# EAGLE design CH1 (EAGLE 9.2.2)
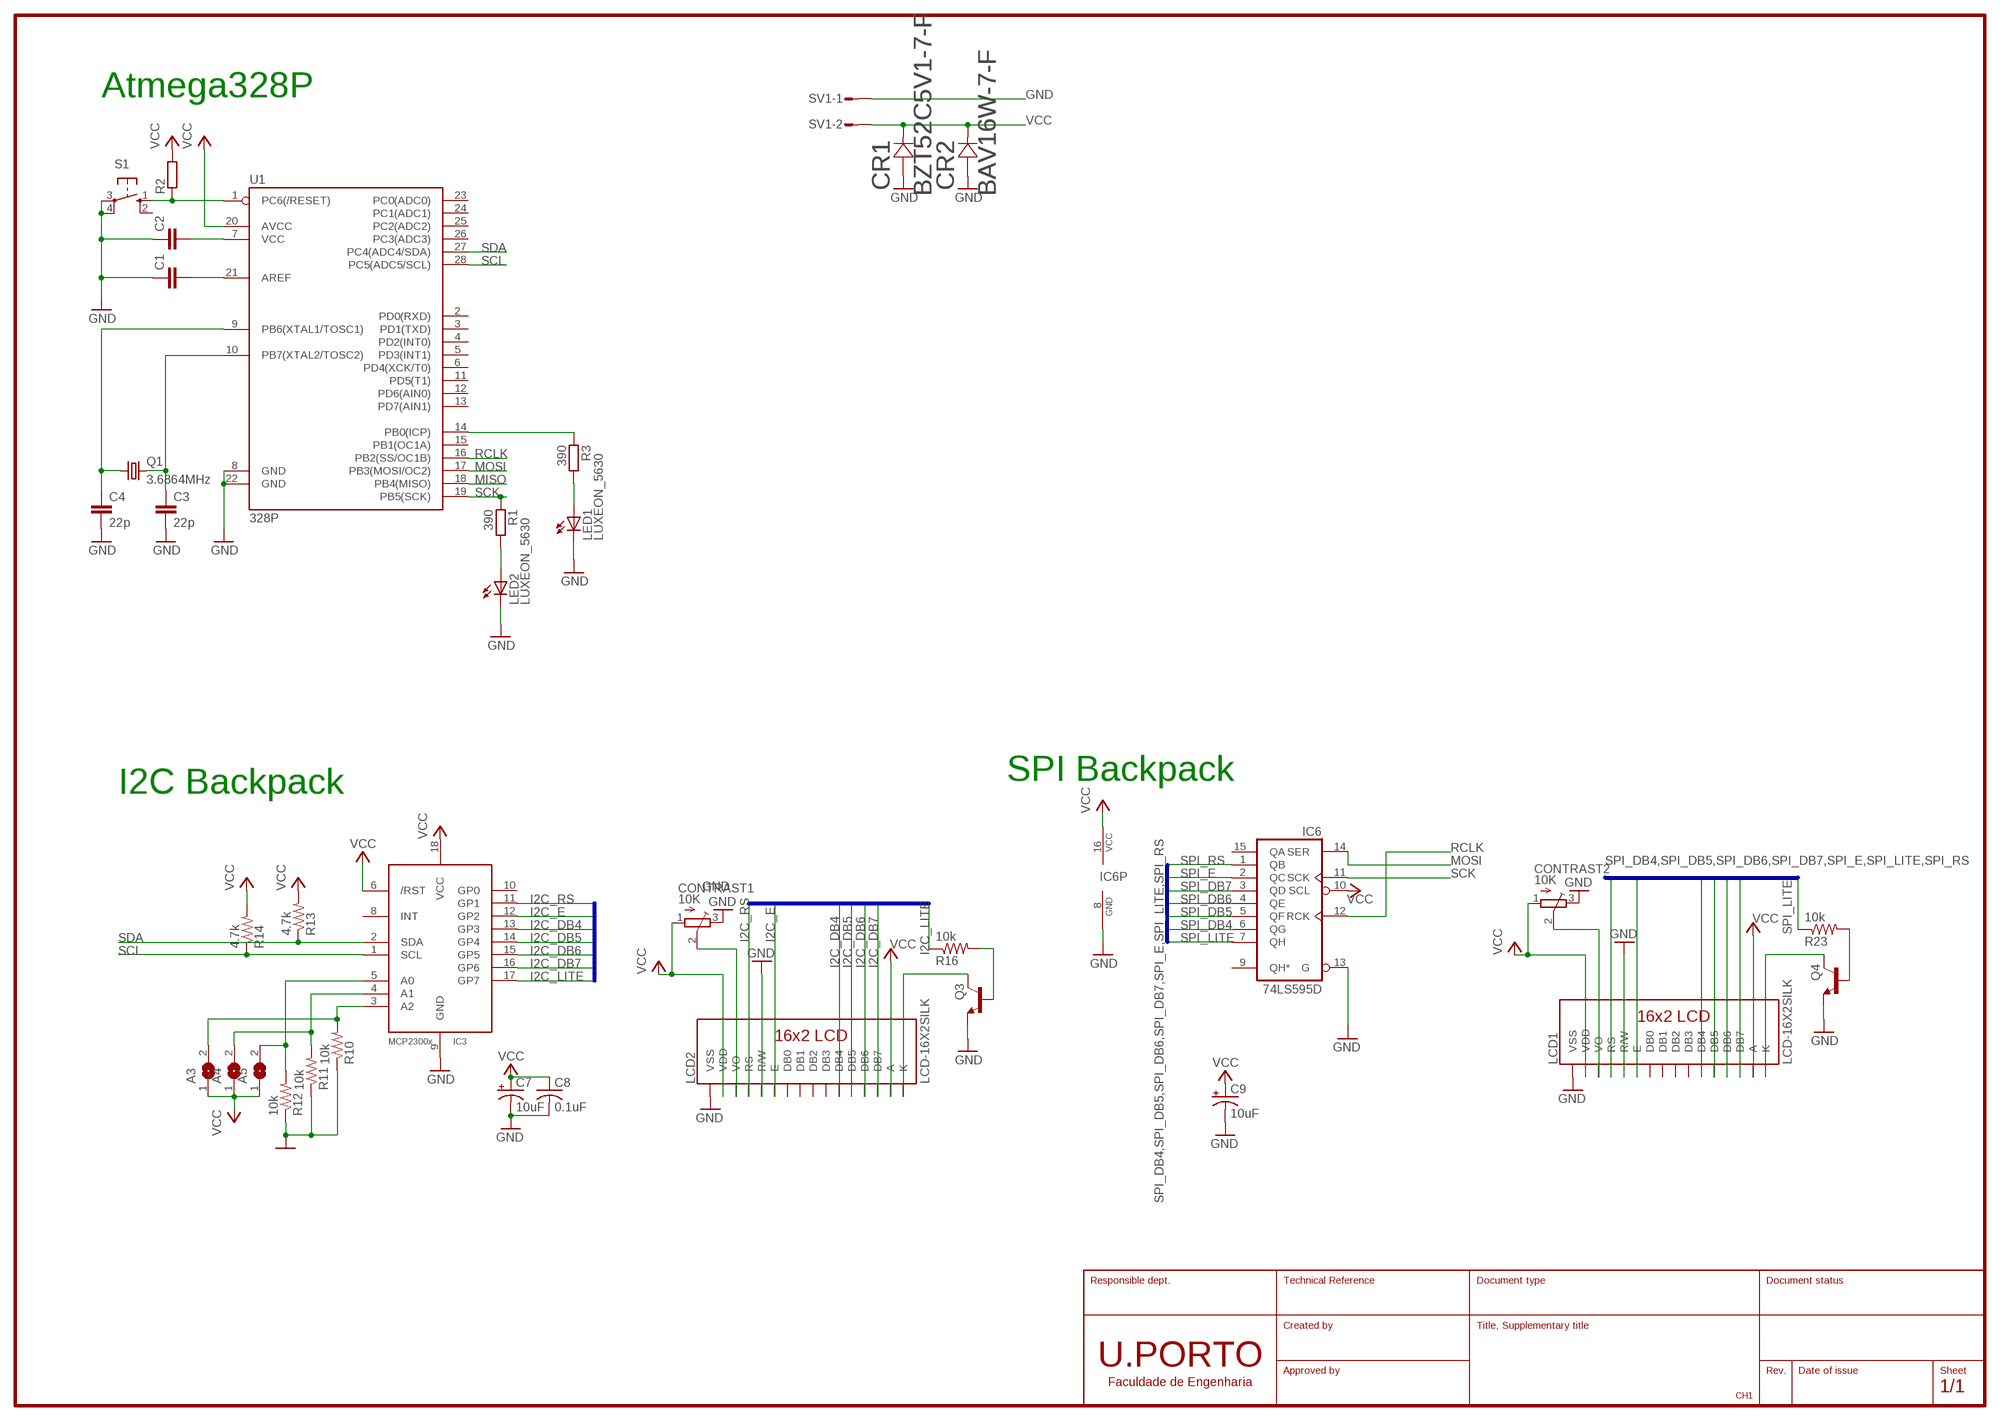
[diagram p0: schematic, sheet 1]

## Parts
A3  SJ  [SJ]
A4  SJ  [SJ]
A5  SJ  [SJ]
C1  C-EUC1206  [C1206]
C2  C-EUC1206  [C1206]
C3  22p  C-EUC1206  [C1206]
C4  22p  C-EUC1206  [C1206]
C7  10uF  CPOL-USA/3216-18R  [A/3216-18R]
C8  0.1uF  C-USC0805K  [C0805K]
C9  10uF  CPOL-USA/3216-18R  [A/3216-18R]
CONTRAST1  10K  TRIMPOTTC33X  [TC33X]
CONTRAST2  10K  TRIMPOTTC33X  [TC33X]
CR1  BZT52C5V1-7-F  [SOD123]
CR2  BAV16W-7-F  [SOD123]
IC3  MCP2300X/SO  [SO18W]
IC6  74LS595D  [SO16]
LCD1  LCD-16X2SILK  [LCD-16X2]
LCD2  LCD-16X2SILK  [LCD-16X2]
LED1  LUXEON_5630  [LUXEON_5630]
LED2  LUXEON_5630  [LUXEON_5630]
Q1  3.6864MHz  CRYSTALHC49S  [HC49/S]
Q3  MMBT2222ALT1-NPN-SOT23-BEC  [SOT23-BEC]
Q4  MMBT2222ALT1-NPN-SOT23-BEC  [SOT23-BEC]
R1  390  R-EU_R1206  [R1206]
R2  R-EU_R1206  [R1206]
R3  390  R-EU_R1206  [R1206]
R10  10k  R-US_R0805  [R0805]
R11  10k  R-US_R0805  [R0805]
R12  10k  R-US_R0805  [R0805]
R13  4.7k  R-US_R0805  [R0805]
R14  4.7k  R-US_R0805  [R0805]
R16  10k  R-US_R0805  [R0805]
R23  10k  R-US_R0805  [R0805]
S1  SWITCH-OMRON  [SWITCH-OMRON_B3F-10XX]
SV1  L02P  [L02P]
U1  328P  ATMEGA328P-PDIP  [MICROCONTROLLER_DIP28]

## Nets
GND: C1.1 C2.1 C3.2 C4.2 C7.- C8.2 C9.- CONTRAST1.3(E) CONTRAST2.3(E) CR1.2 CR2.2 IC3.9(GND) IC6.8(GND) IC6.13(G) LCD1.1(VSS) LCD1.5(R/W) LCD2.1(VSS) LCD2.5(R/W) LED1.1@1(C) LED1.1@2(C) LED2.1@1(C) LED2.1@2(C) Q3.E Q4.E R10.1 R11.1 R12.1 S1.3(P) S1.4(P1) SV1.1 U1.8(GND) U1.22(GND)
I2C_DB4: IC3.13(GP3) LCD2.11(DB4)
I2C_DB5: IC3.14(GP4) LCD2.12(DB5)
I2C_DB6: IC3.15(GP5) LCD2.13(DB6)
I2C_DB7: IC3.16(GP6) LCD2.14(DB7)
I2C_E: IC3.12(GP2) LCD2.6(E)
I2C_LITE: IC3.17(GP7) R16.1
I2C_RS: IC3.11(GP1) LCD2.4(RS)
MISO: U1.18(PB4(MISO))
MOSI: IC6.14(SER) U1.17(PB3(MOSI/OC2))
N$1: C3.1 Q1.2 U1.10(PB7(XTAL2/TOSC2))
N$2: C4.1 Q1.1 U1.9(PB6(XTAL1/TOSC1))
N$3: C2.2 U1.7(VCC)
N$4: C1.2 U1.21(AREF)
N$5: LED1.2(A) R3.2
N$6: LED2.2(A) R1.2
N$7: R2.1 S1.1(S) U1.1(PC6(/RESET))
N$8: R3.1 U1.14(PB0(ICP))
N$14: A5.2 IC3.5(A0) R12.2
N$15: A4.2 IC3.4(A1) R11.2
N$16: A3.2 IC3.3(A2) R10.2
N$18: LCD2.16(K) Q3.C
N$19: Q3.B R16.2
N$20: CONTRAST1.2(S) LCD2.3(VO)
N$25: LCD1.16(K) Q4.C
N$26: Q4.B R23.2
N$27: CONTRAST2.2(S) LCD1.3(VO)
RCLK: IC6.12(RCK) U1.16(PB2(SS/OC1B))
SCK: IC6.11(SCK) R1.1 U1.19(PB5(SCK))
SCL: IC3.1(SCL) R14.1 U1.28(PC5(ADC5/SCL))
SDA: IC3.2(SDA) R13.1 U1.27(PC4(ADC4/SDA))
SPI_DB4: IC6.6(QG) LCD1.11(DB4)
SPI_DB5: IC6.5(QF) LCD1.12(DB5)
SPI_DB6: IC6.4(QE) LCD1.13(DB6)
SPI_DB7: IC6.3(QD) LCD1.14(DB7)
SPI_E: IC6.2(QC) LCD1.6(E)
SPI_LITE: IC6.7(QH) R23.1
SPI_RS: IC6.1(QB) LCD1.4(RS)
VCC: A3.1 A4.1 A5.1 C7.+ C8.1 C9.+ CONTRAST1.1(A) CONTRAST2.1(A) CR1.1 CR2.1 IC3.6(/RST) IC3.18(VCC) IC6.10(SCL) IC6.16(VCC) LCD1.2(VDD) LCD1.15(A) LCD2.2(VDD) LCD2.15(A) R2.2 R13.2 R14.2 SV1.2 U1.20(AVCC)
Unconnected: IC3.8(INT) IC3.10(GP0) IC6.9(QH*) IC6.15(QA) LCD1.7(DB0) LCD1.8(DB1) LCD1.9(DB2) LCD1.10(DB3) LCD2.7(DB0) LCD2.8(DB1) LCD2.9(DB2) LCD2.10(DB3) S1.2(S1) U1.2(PD0(RXD)) U1.3(PD1(TXD)) U1.4(PD2(INT0)) U1.5(PD3(INT1)) U1.6(PD4(XCK/T0)) U1.11(PD5(T1)) U1.12(PD6(AIN0)) U1.13(PD7(AIN1)) U1.15(PB1(OC1A)) U1.23(PC0(ADC0)) U1.24(PC1(ADC1)) U1.25(PC2(ADC2)) U1.26(PC3(ADC3))

## Buses
SPI_DB4,SPI_DB5,SPI_DB6,SPI_DB7,SPI_E,SPI_LITE,SPI_RS
I2C_DB4,I2C_DB5,I2C_DB6,I2C_DB7,I2C_E,I2C_LITE,I2C_RS

## Notes on the sheet
- Atmega328P
- SPI Backpack
- I2C Backpack

## Library data of the parts
A3-A5 = jumper:SJ: SMD solder JUMPER
C1-C4 = resistor:C-EU: CAPACITOR, European symbol
C7 C9 = adafruit:CPOL-US: POLARIZED CAPACITOR, American symbol
C8 = adafruit:C-US: CAPACITOR, American symbol
CONTRAST1 CONTRAST2 = adafruit:TRIMPOT: SMT trimmer potentiometer part number TC33X http://www.ladyada.net/library/eagle
CR1 = trigger_pcb_library:BZT52C5V1-7-F; MANUFACTURER_PART_NUMBER: BZT52C5V17F; VENDOR: Diodes Inc
CR2 = trigger_pcb_library:BAV16W-7-F; MANUFACTURER_PART_NUMBER: BAV16W7F; VENDOR: Diodes Inc
IC3 = adafruit:MCP2300X: MCP23008 Inexpensive i2c i/o expander - 8 general purpose i/o pins with optional pullups
IC6 = 74xx-us:74*595: 8-bit SHIFT REGISTER, output latch
LCD1 LCD2 = SparkFun-Displays:LCD-16X2: Standard text-only 16x2 parallel input LCD Basic 16 character by 2 line display. Typically utilizes the extremely common HD44780 parallel interface chipset SparkFun Products: Basic 16x2 Green <https://www.sparkfun.com/products/255> Basic 8x2 Green <https://www.sparkfun.com/products/11122>; SF_ID: LCD-00255
LED1 LED2 = led:LUXEON_5630: LUXEON 5630 Mid-Power LEDs SD201 Source: Data sheet <www.philipslumileds.com/uploads/351/DS201-pdf> Lumileds 5630 Datasheet DS201 20130228 ©2013 Philips Lumileds Lighting Company.
Q1 = crystal:CRYSTAL: CRYSTAL; OC_FARNELL: 1667008; OC_NEWARK: unknown
Q3 Q4 = transistor:*-NPN-: NPN Transistror BF959 corrected 2008.03.06
R1-R3 = rcl:R-EU_: RESISTOR, European symbol; SPICEPREFIX: R
R10-R14 R16 R23 = adafruit:R-US_: RESISTOR, American symbol
S1 = SBMI-SELE:SWITCH-OMRON: OMRON Switch; MPN: B3F-1000; OC_FARNELL: 176432; OC_NEWARK: 36M3542
SV1 = con-amp-mt:L02P: AMP MT CONNECTOR; OC_FARNELL: unknown; OC_NEWARK: unknown
U1 = SBMI-SELE:ATMEGA328P-PDIP: Atmel 328P Through hole ATMEGA328P uC used in the Arduino 32kb flash, 1k EEPROM, 2k SRAM Datasheet <http://www.sparkfun.com/datasheets/Components/SMD/ATMega328.pdf> SparkFun Products Storefront component: AVR 28 Pin 20MHz 32K 6A/D - ATMega328P <https://www.sparkfun.com/products/9061> (COM-09061) SparkFun Simon Says - Through-Hole Soldering Kit <https://www.sparkfun.com/products/10547> (KIT-10547) SparkFun Learn to Solder - Simon Says <https://www.sparkfun.com/products/13708> (KIT-13708) SparkFun BigTime Watch Kit <https://www.sparkfun.com/products/11734> (KIT-11734) SparkFun ClockIt <https://www.sparkfun.com/products/10930> (KIT-10930) SparkFun Serial Enabled LCD Kit <https://www.sparkfun.com/products/10097> (LCD-10097) SparkFun Simon Tilts - Through Hole Soldering Kit <https://www.sparkfun.com/products/12634> (KIT-12634) SparkFun Frequency Counter Kit <https://www.sparkfun.com/products/10140> (KIT-10140) FabFM Radio Kit <https://www.sparkfun.com/products/11043> (KIT-11043) SparkFun Binary Blaster Kit <https://www.sparkfun.com/products/12037> (KIT-12037) SparkFun Metro-Gnome <https://www.sparkfun.com/products/9236> (KIT-09236) ATmega328 with Arduino Optiboot (Uno) <https://www.sparkfun.com/products/10524> (DEV-10524); PROD_ID: IC-09136

## Board
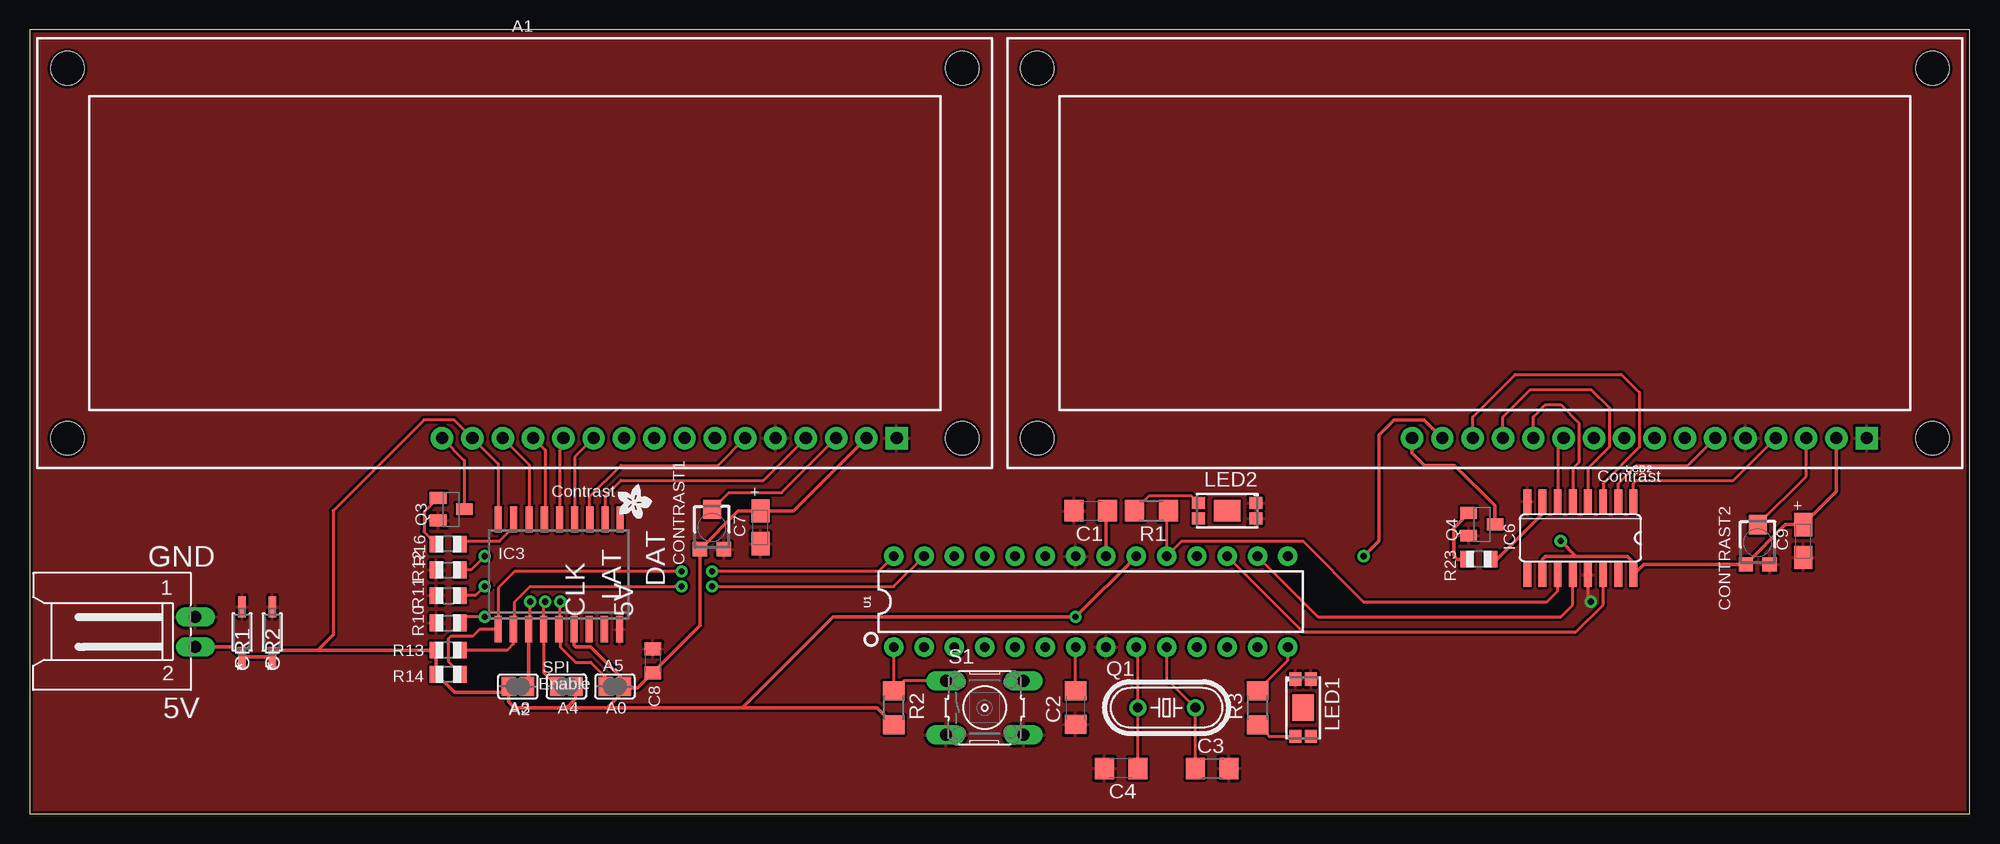
[diagram p1: board, top side]
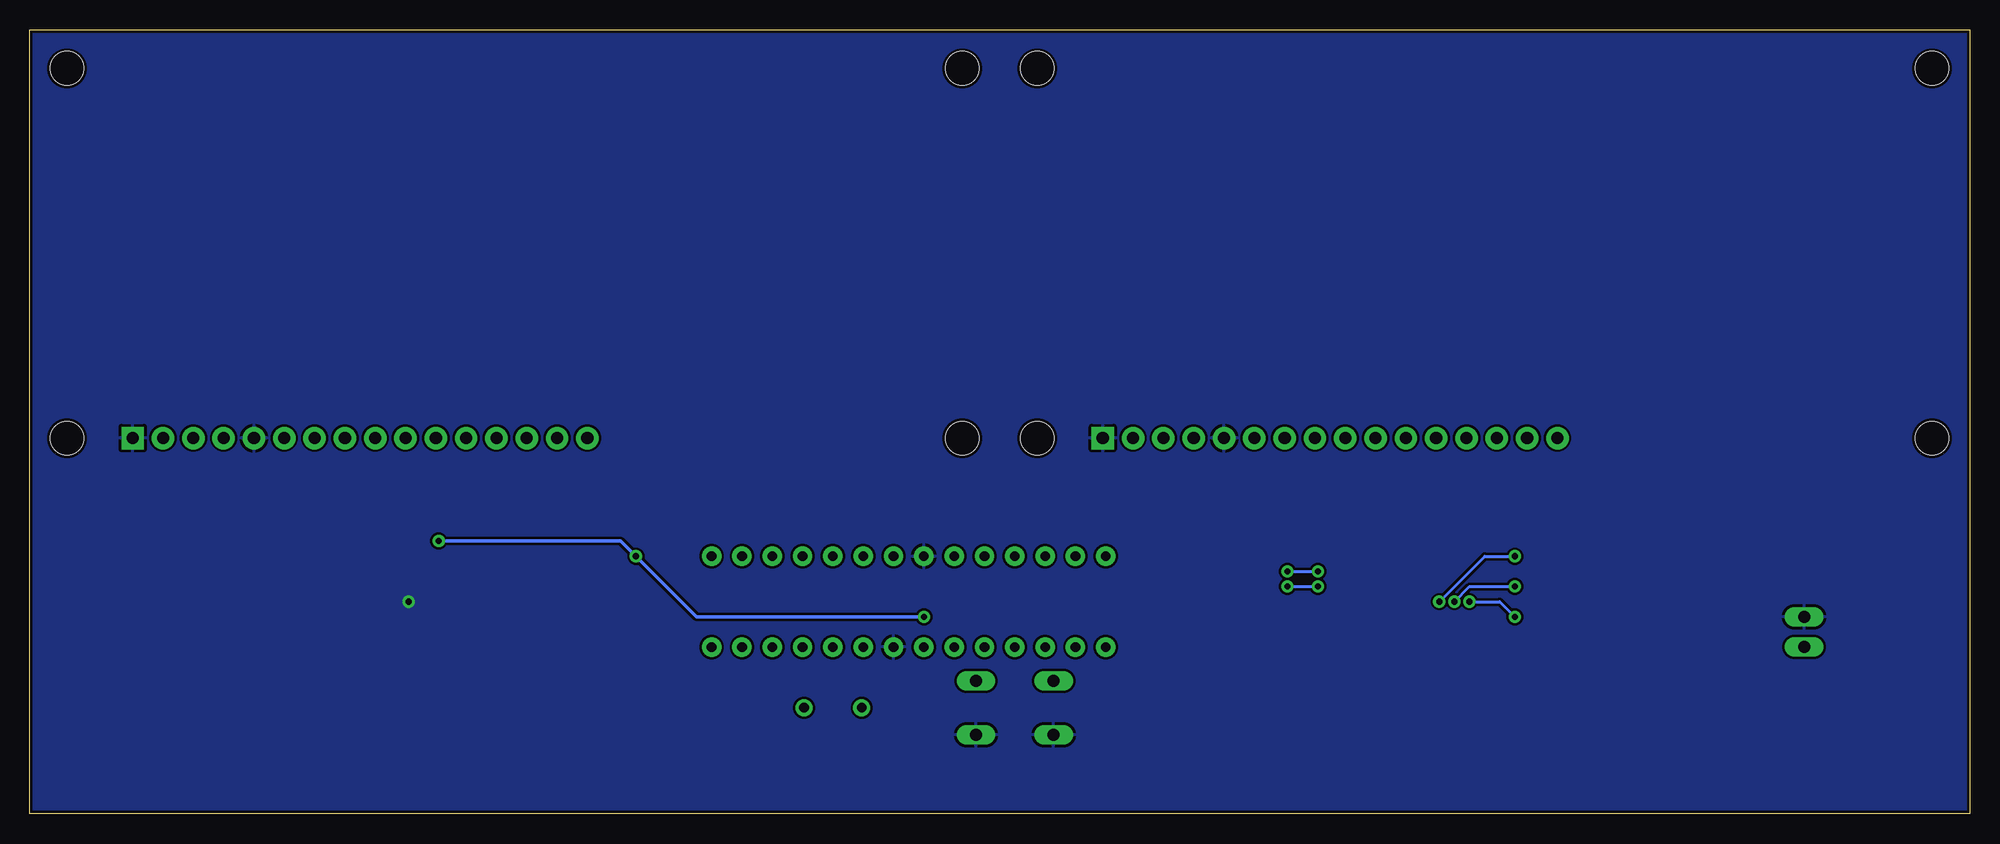
[diagram p2: board, bottom side, seen from below]

Size 162.54 x 65.71 mm. Coordinates in mm from the lower left corner, seen from the top.
Outline: 0,0 162.54,0 162.54,65.71 0,65.71 0,0
Copper layers (1*16): Top 0.035mm / dielectric 1.5mm / Bottom 0.035mm
Design rules "SparkFun": minimum track width 8mil, minimum drill 20mil, track to track 8mil, track to pad 8mil, pad to pad 8mil, via to via 8mil, smd to smd 8mil, copper to edge 10mil, drill to drill 8mil, minimum pad ring 12mil, minimum via ring 10mil, stop-mask expansion 4mil, vias tented up to drill 25mil, thermal gap 10mil

### Footprints (pad centres in the part's own frame; a part is rotated, then mirrored left to right if it is on the bottom)
SJ = smd 1.168 x 1.6: 1 -0.762,0; 2 0.762,0
C1206 = smd 1.6 x 1.8: 1 -1.4,0; 2 1.4,0
A/3216-18R = smd 1.95 x 1.5: + 1.375,0; - -1.375,0
C0805K = smd 1.1 x 1.4: 1 -1,0; 2 1,0
TC33X = smd 1.2 x 1.2: 1 -1,-1.825; 3 1,-1.825 | smd 1.5 x 1.6: 2 0,1.5
SOD123 = smd 1.753 x 0.61: 1 -2.106,0; 2 2.106,0
SO18W = smd 0.6 x 2.2: 1 -4.445,-4.6; 2 -3.175,-4.6; 3 -1.905,-4.6; 4 -0.635,-4.6; 5 0.635,-4.6; 6 1.905,-4.6; 7 3.175,-4.6; 8 4.445,-4.6; 9 5.715,-4.6; 10 5.775,4.6; 11 4.505,4.6; 12 3.235,4.6; 13 1.965,4.6; 14 0.695,4.6; 15 -0.575,4.6; 16 -1.845,4.6; 17 -3.145,4.6; 18 -4.445,4.6
SO16 = smd 0.66 x 2.032: 1 -4.445,-3.073; 2 -3.175,-3.073; 3 -1.905,-3.073; 4 -0.635,-3.073; 5 0.635,-3.073; 6 1.905,-3.073; 7 3.175,-3.073; 8 4.445,-3.073; 9 4.445,3.073; 10 3.175,3.073; 11 1.905,3.073; 12 0.635,3.073; 13 -0.635,3.073; 14 -1.905,3.073; 15 -3.175,3.073; 16 -4.445,3.073
LCD-16X2 = drill 1.016 pad 1.88 square: 1 -32,15.5 | drill 1.016 pad 1.88: 2 -29.46,15.5; 3 -26.92,15.5; 4 -24.38,15.5; 5 -21.84,15.5; 6 -19.3,15.5; 7 -16.76,15.5; 8 -14.22,15.5; 9 -11.68,15.5; 10 -9.14,15.5; 11 -6.6,15.5; 12 -4.06,15.5; 13 -1.52,15.5; 14 1.02,15.5; 15 3.56,15.5; 16 6.1,15.5 | hole 2.8: -37.5,15.5; -37.5,-15.5; 37.5,15.5; 37.5,-15.5
LUXEON_5630 = smd 1.1 x 1: 1@1 -2.4,-0.65; 1@2 -2.4,0.65; 2 2.4,-0.65; 4 2.4,0.65 | smd 2.2 x 1.8: 3 0,0
HC49/S = drill 0.813: 1 -2.413,0; 2 2.413,0
SOT23-BEC = smd 1 x 1.4: B -0.95,-1.1; C 0,1.1; E 0.95,-1.1
R1206 = smd 1.6 x 1.803: 1 -1.422,0; 2 1.422,0
R0805 = smd 1.1 x 1.4: 1 -1,0; 2 1,0
SWITCH-OMRON_B3F-10XX = drill 1.016 long: 1 -3.251,2.261; 2 3.251,2.261; 3 -3.251,-2.261; 4 3.251,-2.261
L02P = drill 1.016 long: 1 1.25,-6.25; 2 -1.25,-6.25
MICROCONTROLLER_DIP28 = drill 0.813 pad 1.626: 1 -16.51,-3.81; 2 -13.97,-3.81; 3 -11.43,-3.81; 4 -8.89,-3.81; 5 -6.35,-3.81; 6 -3.81,-3.81; 7 -1.27,-3.81; 8 1.27,-3.81; 9 3.81,-3.81; 10 6.35,-3.81; 11 8.89,-3.81; 12 11.43,-3.81; 13 13.97,-3.81; 14 16.51,-3.81; 15 16.51,3.81; 16 13.97,3.81; 17 11.43,3.81; 18 8.89,3.81; 19 6.35,3.81; 20 3.81,3.81; 21 1.27,3.81; 22 -1.27,3.81; 23 -3.81,3.81; 24 -6.35,3.81; 25 -8.89,3.81; 26 -11.43,3.81; 27 -13.97,3.81; 28 -16.51,3.81

### Placement (x,y rotation side)
A3  40.89,10.67 0 top
A4  44.96,10.67 180 top
A5  49.02,10.67 180 top
C1  88.9,25.4 0 top
C2  87.63,8.89 90 top
C3  99.06,3.81 0 top
C4  91.44,3.81 180 top
C7  61.21,24 90 top
C8  52.2,12.83 90 top
C9  148.59,22.86 90 top
CONTRAST1  57.15,24 0 top
CONTRAST2  144.78,22.73 0 top
CR1  17.78,15.24 90 top
CR2  20.32,15.24 90 top
IC3  43.69,20.07 0 top
IC6  129.92,23.11 180 top
LCD1  121.92,46.99 180 top
LCD2  40.64,46.99 180 top
LED1  106.68,8.89 270 top
LED2  100.33,25.4 180 top
Q1  95.25,8.89 0 top
Q3  35.31,25.53 270 top
Q4  121.67,24.26 270 top
R1  93.98,25.4 180 top
R2  72.39,8.89 270 top
R3  102.87,8.89 270 top
R10  35.05,16 0 top
R11  35.05,18.29 0 top
R12  35.05,20.45 0 top
R13  35.05,13.72 180 top
R14  35.05,11.68 180 top
R16  35.05,22.61 180 top
R23  121.41,21.34 180 top
S1  80.01,8.89 0 top
SV1  7.62,15.24 90 top
U1  88.9,17.78 0 top
U$2  [ADAFRUIT200MIL]  50.67,26.29 270 top

### Tracks (layer width: path | path; a pad name or v marks a point on that pad's centre or on a via)
GND  (via drill 0.51)
  Top 0.254: IC6.13 130.56,18.03 v130.81,17.78
  pour Top: -3.81,69.85 166.37,69.85 166.37,-3.81 -3.81,-3.81
  pour Bottom: -2.54,68.58 -2.54,-2.54 165.1,-2.54 165.1,68.58
I2C_DB4
  Top 0.254: LCD2.11 45.65,29.9 IC3.13
I2C_DB5
  Top 0.254: LCD2.12 44.7,30.73 44.38,30.41 IC3.14
I2C_DB6
  Top 0.254: LCD2.13 43.17,30.48 | 43.18,30.48 43.18,24.73
  Top 0.305: 43.17,30.48 43.18,30.48 | 43.18,24.73 IC3.15
I2C_DB7
  Top 0.254: LCD2.14 41.84,29.27 IC3.16
I2C_E
  Top 0.254: IC3.12 46.92,26.6 49.53,29.21 57.66,29.21 LCD2.6
I2C_LITE
  Top 0.254: 36.31,22.86 39.37,22.86 40.54,24.03
  Top 0.305: R16.1 36.31,22.86 | 40.54,24.03 IC3.17
I2C_RS
  Top 0.254: 48.26,24.73 48.26,26.67 49.53,27.94 61.47,27.94 LCD2.4
  Top 0.305: IC3.11 48.26,24.73
MOSI
  Top 0.254: U1.17 106.68,15.24 129.54,15.24 131.83,17.53 IC6.14
N$1
  Top 0.254: U1.10 95.25,11.3 Q1.2 | C3.1 Q1.2
  Top 0.305: Q1.2
N$2
  Top 0.254: C4.1 Q1.1 92.84,13.84 U1.9
N$3
  Top 0.254: C2.2 U1.7
N$4
  Top 0.305: C1.2 90.17,25.27 U1.21
N$5
  Top 0.254: R3.2 103.85,6.49 LED1.2
N$6
  Top 0.254: R1.2 93.83,26.67 97.31,26.67 LED2.2
N$7
  Top 0.254: S1.1 73.23,11.15 R2.1 U1.1
N$8
  Top 0.254: R3.1 105.41,12.85 U1.14
N$14  (via drill 0.51)
  Top 0.254: 44.45,15.59 v44.45,17.78 | v38.1,21.59 36.96,20.45 R12.2 | 44.45,15.34 44.45,13.97 45.72,12.7 46.99,12.7 48.26,11.43
  Top 0.305: 44.45,15.59 IC3.5 44.45,15.34 | 48.26,11.43 A5.2
  Bottom 0.254: v38.1,21.59 40.64,21.59 v44.45,17.78
N$15  (via drill 0.51)
  Top 0.254: A4.2 43.05,11.81 IC3.4 43.05,17.65 v43.18,17.78 | v38.1,19.05 37.34,18.29 R11.2
  Bottom 0.254: v43.18,17.78 41.91,19.05 v38.1,19.05
N$16  (via drill 0.51)
  Top 0.254: 41.91,15.59 v41.91,17.78 | v38.1,16.51 36.56,16.51 R10.2
  Top 0.305: A3.2 41.78,10.8 IC3.3 41.91,15.59
  Bottom 0.254: v41.91,17.78 39.37,17.78 v38.1,16.51
N$18
  Top 0.254: LCD2.16 36.41,29.62 Q3.C
N$19
  Top 0.254: Q3.B 33.02,25.29 33.02,23.64 R16.2
N$20
  Top 0.254: CONTRAST1.2 58.57,26.92 62.99,26.92 LCD2.3
N$25
  Top 0.305: Q4.C 122.77,25.82 119.38,29.21 116.84,29.21 115.82,30.23 LCD1.16
N$26
  Top 0.305: R23.2 119.64,21.34 119.31,21.66 119.31,23.95 Q4.B
N$27
  Top 0.254: CONTRAST2.2 148.84,28.29 LCD1.3
RCLK
  Top 0.254: U1.16 107.95,16.51 128.27,16.51 129.29,17.53 IC6.12
SCK
  Top 0.254: 95.25,25.25 U1.19 96.52,22.86 106.68,22.86 111.76,17.78 127.13,17.78 128.02,18.67 IC6.11
  Top 0.305: R1.1 95.25,25.25
SCL  (via drill 0.51)
  Top 0.254: U1.28 71.12,20.32 v57.15,20.32 | v54.61,20.32 40.64,20.32 39.24,18.92 IC3.1 37.7,15.47 37.11,14.87 35.27,14.87 35.07,14.67 35.07,12.76 36.05,11.78
  Top 0.305: 36.05,11.78 R14.1
  Bottom 0.254: v57.15,20.32 v54.61,20.32
SDA  (via drill 0.51)
  Top 0.254: 40.64,15.59 40.64,17.78 41.91,19.05 v54.61,19.05 | v57.15,19.05 72.39,19.05 U1.27 | IC3.2 40.51,14.22 40.01,13.72 R13.1
  Top 0.305: IC3.2 40.64,15.59
  Bottom 0.254: v57.15,19.05 v54.61,19.05
SPI_DB4
  Top 0.254: LCD1.11 128.02,30.99 IC6.6
SPI_DB5
  Top 0.254: LCD1.12 125.98,33.27 127,34.29 128.27,34.29 129.79,32.77 129.79,29.46 129.29,28.96 IC6.5
SPI_DB6
  Top 0.254: LCD1.13 123.44,33.27 125.73,35.56 130.81,35.56 132.33,34.04 132.33,30.73 130.56,28.96 IC6.4
SPI_DB7
  Top 0.254: LCD1.14 120.9,33.27 124.46,36.83 133.35,36.83 134.87,35.31 134.87,30.73 131.83,27.69 IC6.3
SPI_E
  Top 0.254: IC6.2 133.1,27.69 134.62,29.21 138.94,29.21 LCD1.6
SPI_LITE
  Top 0.305: IC6.7 126.75,25.15 122.94,21.34 R23.1
SPI_RS
  Top 0.254: IC6.1 134.37,27.69 134.62,27.94 142.75,27.94 LCD1.4
VCC  (via drill 0.51)
  Top 0.254: IC3.18 39.24,29.33 LCD2.15 35.55,33.02 33.02,33.02 25.4,25.4 25.4,14.99
  Top 0.305: A5.1 49.78,11.18 46.99,13.97 45.72,13.97 45.59,14.1 IC3.6 | A5.1 49.9,10.56 50.93,10.56 C8.1 56.15,15.78 CONTRAST1.1 59.35,25.38 C7.+ 63.99,25.38 LCD2.2 | LCD1.2 151.38,27.02 C9.+ 147.11,24.23 CONTRAST2.1 135.23,20.91 IC6.16 134.37,21.08 133.86,21.59 129.54,21.59 | IC6.10 126.75,21.34 127,21.59 129.54,21.59 | 48.37,8.89 49.78,10.3 A5.1 | 44.96,8.89 40.64,8.89 40.13,9.4 A3.1 39.62,10.16 35.58,10.16 R14.2 R13.2 24.13,13.72 | 44.96,8.89 48.37,8.89 | A4.1 45.72,9.65 44.96,8.89 | SV1.2 16.92,13.99 CR1.1 CR2.1 20.9,13.72 24.13,13.72 | 48.37,8.89 59.69,8.89 | 59.69,8.89 70.97,8.89 R2.2 | U1.20 v87.63,16.51 67.31,16.51 59.69,8.89 | LCD1.15 116.83,33.02 114.3,33.02 113.03,31.75 113.03,22.86 v111.76,21.59 | 25.4,14.99 24.13,13.72 | 129.54,21.59 v128.27,22.86
  Bottom 0.305: v87.63,16.51 106.68,16.51 v111.76,21.59 113.03,22.86 v128.27,22.86

### Text on the board
tPlace: A1 | Contrast | Contrast | DAT | LAT | CLK | 5V | SPI | Enable | A2 | A0
tNames: GND | 5V